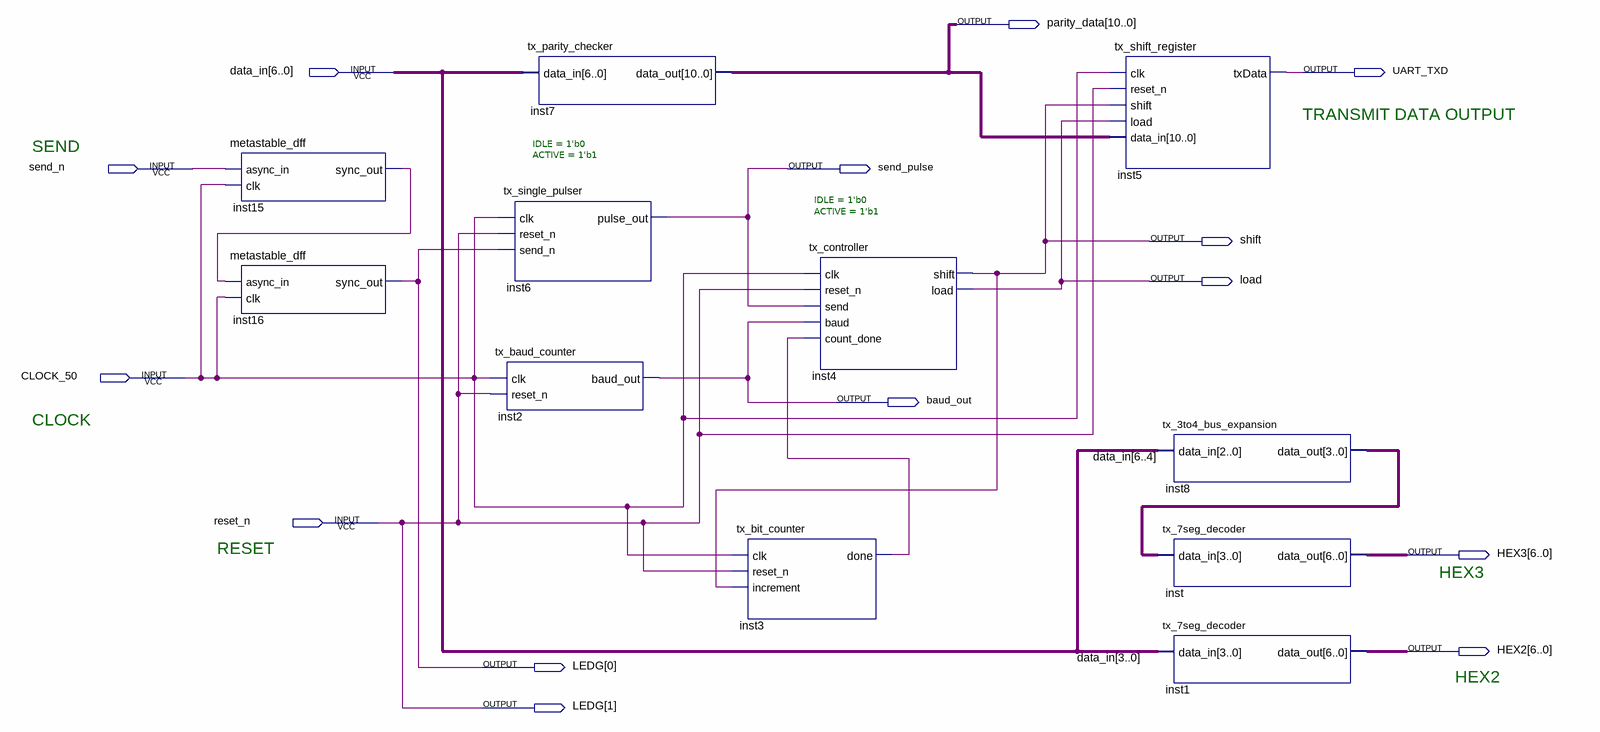
[diagram p0: schematic sheet]
// Quartus schematic transmitter.bdf as structural Verilog: 11 symbols, 14 pins
module transmitter (
  input  [6:0] data_in,
  input  send_n,
  input  CLOCK_50,
  input  reset_n,
  output [10:0] parity_data,
  output UART_TXD,
  output send_pulse,
  output shift,
  output load,
  output baud_out,
  output [6:0] HEX3,
  output [6:0] HEX2,
  output [1:0] LEDG
);

  wire inst3_done, inst15_sync_out;
  wire [3:0] inst8_data_out;

  metastable_dff inst15 (.async_in(send_n), .clk(CLOCK_50), .sync_out(inst15_sync_out));
  metastable_dff inst16 (.async_in(inst15_sync_out), .clk(CLOCK_50), .sync_out(LEDG[0]));
  tx_baud_counter inst2 (.clk(CLOCK_50), .reset_n(reset_n), .baud_out(baud_out));
  tx_parity_checker inst7 (.data_in(data_in), .data_out(parity_data));
  tx_single_pulser #(.IDLE(1'b0), .ACTIVE(1'b1)) inst6 (
    .clk(CLOCK_50), .reset_n(reset_n), .send_n(LEDG[0]), .pulse_out(send_pulse));
  tx_bit_counter inst3 (.clk(CLOCK_50), .reset_n(reset_n), .increment(shift), .done(inst3_done));
  tx_controller #(.IDLE(1'b0), .ACTIVE(1'b1)) inst4 (
    .clk(CLOCK_50), .reset_n(reset_n), .send(send_pulse), .baud(baud_out), .count_done(inst3_done),
    .shift(shift), .load(load));
  tx_shift_register inst5 (
    .clk(CLOCK_50), .reset_n(reset_n), .shift(shift), .load(load), .data_in(parity_data), .txData(UART_TXD));
  tx_3to4_bus_expansion inst8 (.data_in(data_in[6:4]), .data_out(inst8_data_out));
  tx_7seg_decoder inst (.data_in(inst8_data_out), .data_out(HEX3));
  tx_7seg_decoder inst1 (.data_in(data_in[3:0]), .data_out(HEX2));

  assign LEDG[1] = reset_n;

  // Notes on the sheet:
  //   TRANSMIT DATA OUTPUT  
  //   SEND 
  //   CLOCK 
  //   RESET 
  //   HEX3 
  //   HEX2 
endmodule
